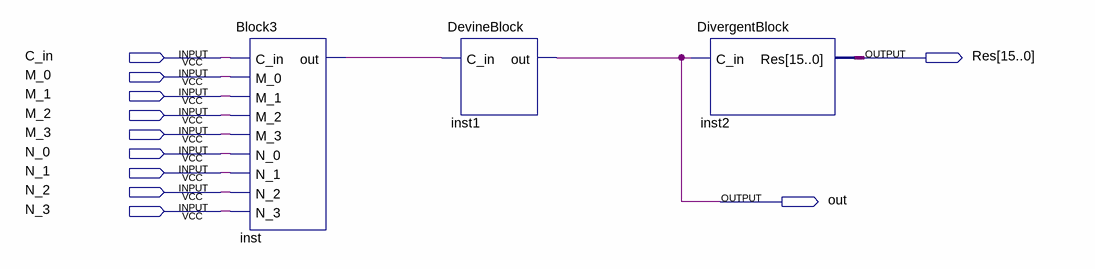
[diagram p0: schematic sheet]
// Quartus schematic Result.bdf as structural Verilog: 3 symbols, 11 pins
module Result (
  input  C_in,
  input  M_0,
  input  M_1,
  input  M_2,
  input  M_3,
  input  N_0,
  input  N_1,
  input  N_2,
  input  N_3,
  output [15:0] Res,
  output out
);

  wire inst_out;

  Block3 inst (
    .C_in(C_in), .M_0(M_0), .M_1(M_1), .M_2(M_2), .M_3(M_3), .N_0(N_0), .N_1(N_1), .N_2(N_2), .N_3(N_3),
    .out(inst_out));
  DevineBlock inst1 (.C_in(inst_out), .out(out));
  DivergentBlock inst2 (.C_in(out), .Res(Res));
endmodule
